# EasyEDA Pro project ReuseBlock_ldo_2025-06-27.epro

# Schematic ldo
Board Name: ldo; Create Date: 2025-06-27; Page Name: P1; Project Name: mousring; Schematic Name: ldo; Update Date: 2025-06-27; Company: EasyEDA.com; Page Size: A4; Version: V1.0
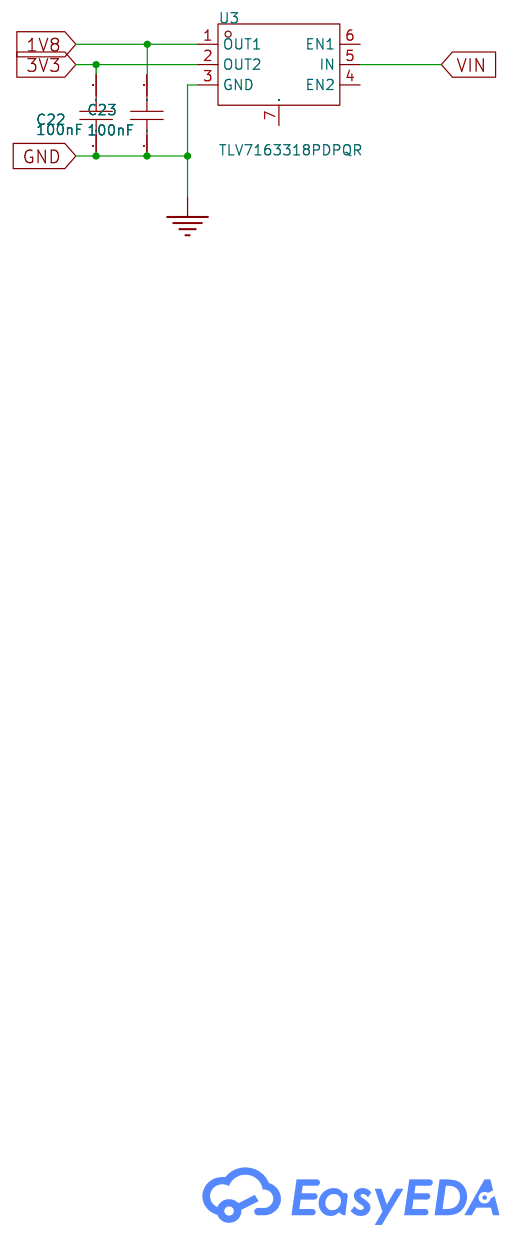
[diagram p0: schematic sheet]

## Parts
C22  100nF  [C0201]
C23  100nF  [C0201]
U3  TLV7163318PDPQR  [XDFN-6_L1.2-W1.2-P0.40-BL-EP]

## Library data of the parts
C22 C23 = C0201X5R104K100NTA: Capacitance:100nF Tolerance:±10% Tolerance:±10% Voltage Rating:10V Temperature Coefficient:X5R; LCSC Part Name: 100nF ±10% 10V; Supplier Part: C115574; Manufacturer: EYANG(宇阳科技); Supplier Footprint: 0201; JLCPCB Part Class: Extended Part; Datasheet: https://atta.szlcsc.com/upload/public/pdf/source/20190320/C377537_BBE5FC54ADCBA21EA65467531FECB98A.pdf; Supplier: LCSC; Tolerance: ±10%; Voltage Rating: 10V; Temperature Coefficient: X5R
U3 = TLV7163318PDPQR: Output Type:Fixed Maximum Input Voltage:5.5V Output Voltage:1.8V；3.3V Output Voltage:1.8V；3.3V Output Current:150mA Dropout Voltage:580mV@(150mA)；420mV@(150mA) standby current:75uA Feature:ESD Protection；Surge Protection；Automatic Discharge Function；Therm; LCSC Part Name: 具有使能功能的 150mA、双通道低压降稳压器; Supplier Part: C2859836; Manufacturer: TI(德州仪器); Supplier Footprint: X2SON-6(1.2x1.2); JLCPCB Part Class: Extended Part; Datasheet: https://www.ti.com/cn/lit/gpn/tlv716p; Supplier: LCSC; Output Type: Fixed; Maximum Input Voltage: 5.5V; Output Voltage: 1.8V；3.3V; Output Current: 150mA; Dropout Voltage: 580mV@(150mA)；420mV@(150mA); standby current: 75uA; Feature: ESD Protection；Surge Protection；Automatic Discharge Function；Thermal Protection(TSD)；Under-voltage Lockout；Overcurrent Protection(OCP)；With ability；Anti-Siphon; Operating Temperature: -40℃~+125℃@(Tj); Output Polarity: Positive electrode; Number of Outputs: 2

## Nets
1V8: U3.1(OUT1)
3V3: C22.2 U3.2(OUT2)
GND: C22.1 C23.1 U3.3(GND)
VIN: U3.5(IN)

Not connected (* = marked no-connect by the designer): C23 2; U3 4(EN2) 6(EN1) 7(EP)
